# EAGLE design sitrep_display (EAGLE 7.7.0)
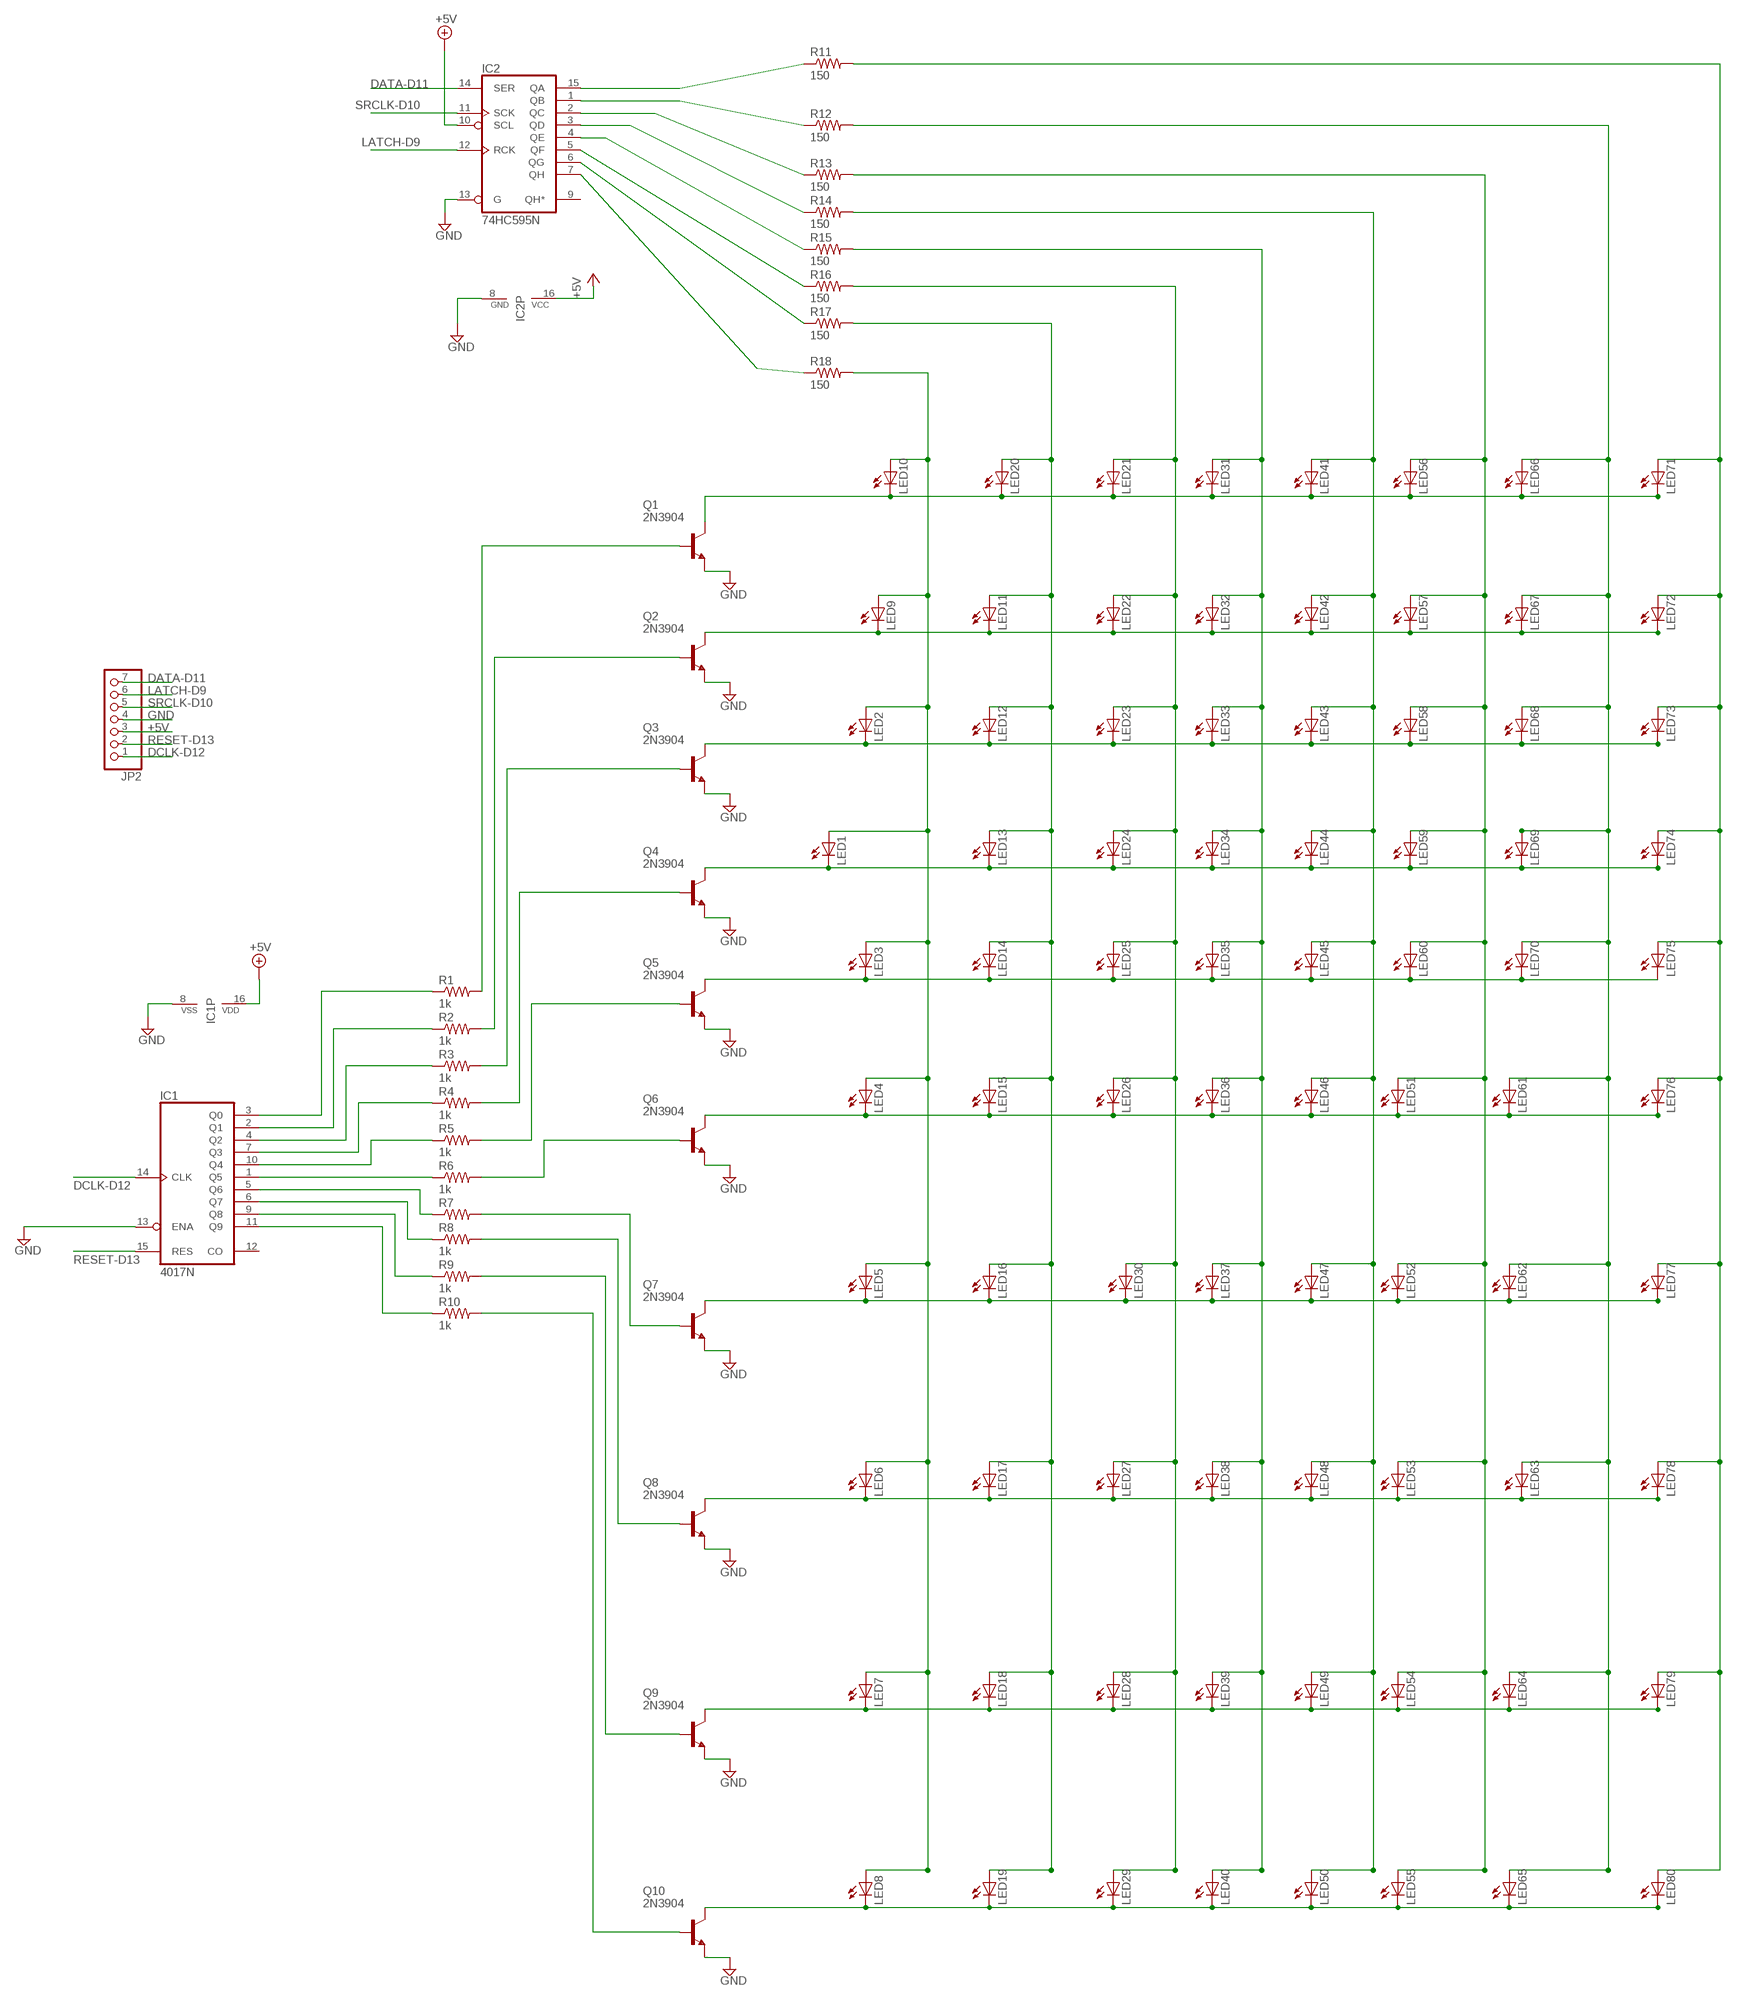
[diagram p0: schematic, sheet 1]

## Parts
IC1  4017N  [DIL16]
IC2  74HC595N  [DIL16]
JP2  PINHD-1X7/90  [1X07/90]
LED1  LED5MM  [LED5MM]
LED2  LED5MM  [LED5MM]
LED3  LED5MM  [LED5MM]
LED4  LED5MM  [LED5MM]
LED5  LED5MM  [LED5MM]
LED6  LED5MM  [LED5MM]
LED7  LED5MM  [LED5MM]
LED8  LED5MM  [LED5MM]
LED9  LED5MM  [LED5MM]
LED10  LED5MM  [LED5MM]
LED11  LED5MM  [LED5MM]
LED12  LED5MM  [LED5MM]
LED13  LED5MM  [LED5MM]
LED14  LED5MM  [LED5MM]
LED15  LED5MM  [LED5MM]
LED16  LED5MM  [LED5MM]
LED17  LED5MM  [LED5MM]
LED18  LED5MM  [LED5MM]
LED19  LED5MM  [LED5MM]
LED20  LED5MM  [LED5MM]
LED21  LED5MM  [LED5MM]
LED22  LED5MM  [LED5MM]
LED23  LED5MM  [LED5MM]
LED24  LED5MM  [LED5MM]
LED25  LED5MM  [LED5MM]
LED26  LED5MM  [LED5MM]
LED27  LED5MM  [LED5MM]
LED28  LED5MM  [LED5MM]
LED29  LED5MM  [LED5MM]
LED30  LED5MM  [LED5MM]
LED31  LED5MM  [LED5MM]
LED32  LED5MM  [LED5MM]
LED33  LED5MM  [LED5MM]
LED34  LED5MM  [LED5MM]
LED35  LED5MM  [LED5MM]
LED36  LED5MM  [LED5MM]
LED37  LED5MM  [LED5MM]
LED38  LED5MM  [LED5MM]
LED39  LED5MM  [LED5MM]
LED40  LED5MM  [LED5MM]
LED41  LED5MM  [LED5MM]
LED42  LED5MM  [LED5MM]
LED43  LED5MM  [LED5MM]
LED44  LED5MM  [LED5MM]
LED45  LED5MM  [LED5MM]
LED46  LED5MM  [LED5MM]
LED47  LED5MM  [LED5MM]
LED48  LED5MM  [LED5MM]
LED49  LED5MM  [LED5MM]
LED50  LED5MM  [LED5MM]
LED51  LED5MM  [LED5MM]
LED52  LED5MM  [LED5MM]
LED53  LED5MM  [LED5MM]
LED54  LED5MM  [LED5MM]
LED55  LED5MM  [LED5MM]
LED56  LED5MM  [LED5MM]
LED57  LED5MM  [LED5MM]
LED58  LED5MM  [LED5MM]
LED59  LED5MM  [LED5MM]
LED60  LED5MM  [LED5MM]
LED61  LED5MM  [LED5MM]
LED62  LED5MM  [LED5MM]
LED63  LED5MM  [LED5MM]
LED64  LED5MM  [LED5MM]
LED65  LED5MM  [LED5MM]
LED66  LED5MM  [LED5MM]
LED67  LED5MM  [LED5MM]
LED68  LED5MM  [LED5MM]
LED69  LED5MM  [LED5MM]
LED70  LED5MM  [LED5MM]
LED71  LED5MM  [LED5MM]
LED72  LED5MM  [LED5MM]
LED73  LED5MM  [LED5MM]
LED74  LED5MM  [LED5MM]
LED75  LED5MM  [LED5MM]
LED76  LED5MM  [LED5MM]
LED77  LED5MM  [LED5MM]
LED78  LED5MM  [LED5MM]
LED79  LED5MM  [LED5MM]
LED80  LED5MM  [LED5MM]
Q1  2N3904  [TO92]
Q2  2N3904  [TO92]
Q3  2N3904  [TO92]
Q4  2N3904  [TO92]
Q5  2N3904  [TO92]
Q6  2N3904  [TO92]
Q7  2N3904  [TO92]
Q8  2N3904  [TO92]
Q9  2N3904  [TO92]
Q10  2N3904  [TO92]
R1  1k  R-US_0204/2V  [0204V]
R2  1k  R-US_0204/2V  [0204V]
R3  1k  R-US_0204/2V  [0204V]
R4  1k  R-US_0204/2V  [0204V]
R5  1k  R-US_0204/2V  [0204V]
R6  1k  R-US_0204/2V  [0204V]
R7  R-US_0204/2V  [0204V]
R8  1k  R-US_0204/2V  [0204V]
R9  1k  R-US_0204/2V  [0204V]
R10  1k  R-US_0204/2V  [0204V]
R11  150  R-US_0207/2V  [0207/2V]
R12  150  R-US_0207/2V  [0207/2V]
R13  150  R-US_0207/2V  [0207/2V]
R14  150  R-US_0207/2V  [0207/2V]
R15  150  R-US_0207/2V  [0207/2V]
R16  150  R-US_0207/2V  [0207/2V]
R17  150  R-US_0207/2V  [0207/2V]
R18  150  R-US_0207/2V  [0207/2V]

## Nets
+5V: IC1.16(VDD) IC2.10(SCL) IC2.16(VCC) JP2.3
DATA-D11: IC2.14(SER) JP2.7
DCLK-D12: IC1.14(CLK) JP2.1
GND: IC1.8(VSS) IC1.13(ENA) IC2.8(GND) IC2.13(G) JP2.4 Q1.3(E) Q2.3(E) Q3.3(E) Q4.3(E) Q5.3(E) Q6.3(E) Q7.3(E) Q8.3(E) Q9.3(E) Q10.3(E)
LATCH-D9: IC2.12(RCK) JP2.6
N$7: IC2.15(QA) R11.1
N$8: IC2.1(QB) R12.1
N$9: IC2.2(QC) R13.1
N$10: IC2.3(QD) R14.1
N$11: IC2.4(QE) R15.1
N$12: IC2.5(QF) R16.1
N$13: IC2.6(QG) R17.1
N$14: IC2.7(QH) R18.1
N$16: LED11.A LED12.A LED13.A LED14.A LED15.A LED16.A LED17.A LED18.A LED19.A LED20.A R17.2
N$17: LED21.A LED22.A LED23.A LED24.A LED25.A LED26.A LED27.A LED28.A LED29.A LED30.A R16.2
N$18: LED31.A LED32.A LED33.A LED34.A LED35.A LED36.A LED37.A LED38.A LED39.A LED40.A R15.2
N$19: LED41.A LED42.A LED43.A LED44.A LED45.A LED46.A LED47.A LED48.A LED49.A LED50.A R14.2
N$20: LED51.A LED52.A LED53.A LED54.A LED55.A LED56.A LED57.A LED58.A LED59.A LED60.A R13.2
N$21: LED61.A LED62.A LED63.A LED64.A LED65.A LED66.A LED67.A LED68.A LED69.A LED70.A R12.2
N$22: LED71.A LED72.A LED73.A LED74.A LED75.A LED76.A LED77.A LED78.A LED79.A LED80.A R11.2
N$24: LED1.A LED2.A LED3.A LED4.A LED5.A LED6.A LED7.A LED8.A LED9.A LED10.A R18.2
N$30: LED10.K(C) LED20.K(C) LED21.K(C) LED31.K(C) LED41.K(C) LED56.K(C) LED66.K(C) LED71.K(C) Q1.1(C)
N$31: LED9.K(C) LED11.K(C) LED22.K(C) LED32.K(C) LED42.K(C) LED57.K(C) LED67.K(C) LED72.K(C) Q2.1(C)
N$32: LED3.K(C) LED14.K(C) LED25.K(C) LED35.K(C) LED45.K(C) LED60.K(C) LED70.K(C) LED75.K(C) Q5.1(C)
N$33: LED1.K(C) LED13.K(C) LED24.K(C) LED34.K(C) LED44.K(C) LED59.K(C) LED69.K(C) LED74.K(C) Q4.1(C)
N$35: LED4.K(C) LED15.K(C) LED26.K(C) LED36.K(C) LED46.K(C) LED51.K(C) LED61.K(C) LED76.K(C) Q6.1(C)
N$37: LED5.K(C) LED16.K(C) LED30.K(C) LED37.K(C) LED47.K(C) LED52.K(C) LED62.K(C) LED77.K(C) Q7.1(C)
N$38: LED6.K(C) LED17.K(C) LED27.K(C) LED38.K(C) LED48.K(C) LED53.K(C) LED63.K(C) LED78.K(C) Q8.1(C)
N$39: LED2.K(C) LED12.K(C) LED23.K(C) LED33.K(C) LED43.K(C) LED58.K(C) LED68.K(C) LED73.K(C) Q3.1(C)
N$48: LED7.K(C) LED18.K(C) LED28.K(C) LED39.K(C) LED49.K(C) LED54.K(C) LED64.K(C) LED79.K(C) Q9.1(C)
N$57: LED8.K(C) LED19.K(C) LED29.K(C) LED40.K(C) LED50.K(C) LED55.K(C) LED65.K(C) LED80.K(C) Q10.1(C)
N$58: Q1.2(B) R1.2
N$59: Q2.2(B) R2.2
N$60: Q3.2(B) R3.2
N$61: Q4.2(B) R4.2
N$62: Q5.2(B) R5.2
N$63: Q6.2(B) R6.2
N$64: Q7.2(B) R7.2
N$65: Q8.2(B) R8.2
N$66: Q9.2(B) R9.2
N$67: Q10.2(B) R10.2
N$68: IC1.3(Q0) R1.1
N$69: IC1.2(Q1) R2.1
N$70: IC1.4(Q2) R3.1
N$71: IC1.7(Q3) R4.1
N$72: IC1.10(Q4) R5.1
N$73: IC1.1(Q5) R6.1
N$74: IC1.5(Q6) R7.1
N$75: IC1.6(Q7) R8.1
N$76: IC1.9(Q8) R9.1
N$77: IC1.11(Q9) R10.1
RESET-D13: IC1.15(RES) JP2.2
SRCLK-D10: IC2.11(SCK) JP2.5
Unconnected: IC1.12(CO) IC2.9(QH*)

## Library data of the parts
IC1 = 40xx:4017: COUNTER/DIVIDER
IC2 = 74xx-eu:74*595: 8-bit SHIFT REGISTER, output latch
JP2 = pinhead:PINHD-1X7: PIN HEADER
LED1-LED80 = adafruit:LED: LED OSRAM: - CHIPLED LG R971, LG N971, LY N971, LG Q971, LY Q971, LO R971, LY R971 LH N974, LH R974 LS Q976, LO Q976, LY Q976 LO Q996 - Hyper CHIPLED LW Q18S LB Q993, LB Q99A, LB R99A - SideLED LS A670, LO A670, LY A670, LG A670, LP A670 LB A673, LV A673, LT A673, LW A673 LH A674 LY A675 LS A676, LA A676, LO A676, LY A676, LW A676 LS A679, LY A679, LG A679 - Hyper Micro SIDELED® LS Y876, LA Y876, LO Y876, LY Y876 LT Y87S - SmartLED LW L88C, LW L88S LB L89C, LB L89S, LG L890 LS L89K, LO L89K, LY L89K LS L896, LA L896, LO L896, LY L896 - TOPLED LS T670, LO T670, LY T670, LG T670, LP T670 LSG T670, LSP T670, LSY T670, LOP T670, LYG T670 LG T671, LOG T671, LSG T671 LB T673, LV T673, LT T673, LW T673 LH T674 LS T676, LA T676, LO T676, LY T676, LB T676, LH T676, LSB T676, LW T676 LB T67C, LV T67C, LT T67C, LS T67K, LO T67K, LY T67K, LW E67C LS E67B, LA E67B, LO E67B, LY E67B, LB E67C, LV E67C, LT E67C LW T67C LS T679, LY T679, LG T679 LS T770, LO T770, LY T770, LG T770, LP T770 LB T773, LV T773, LT T773, LW T773 LH T774 LS E675, LA E675, LY E675, LS T675 LS T776, LA T776, LO T776, LY T776, LB T776 LHGB T686 LT T68C, LB T68C - Hyper Mini TOPLED® LB M676 - Mini TOPLED Santana® LG M470 LS M47K, LO M47K, LY M47K Source: http://www.osram.convergy.de/
Q1-Q10 = transistor-npn:2N3904: NPN Transistor
R1-R10 = resistor:R-US_: RESISTOR, American symbol
R11-R18 = adafruit:R-US_: RESISTOR, American symbol

## Net classes
0 default: width 0.305 mm, drill 0.508 mm, clearance 0.254 mm

## Board
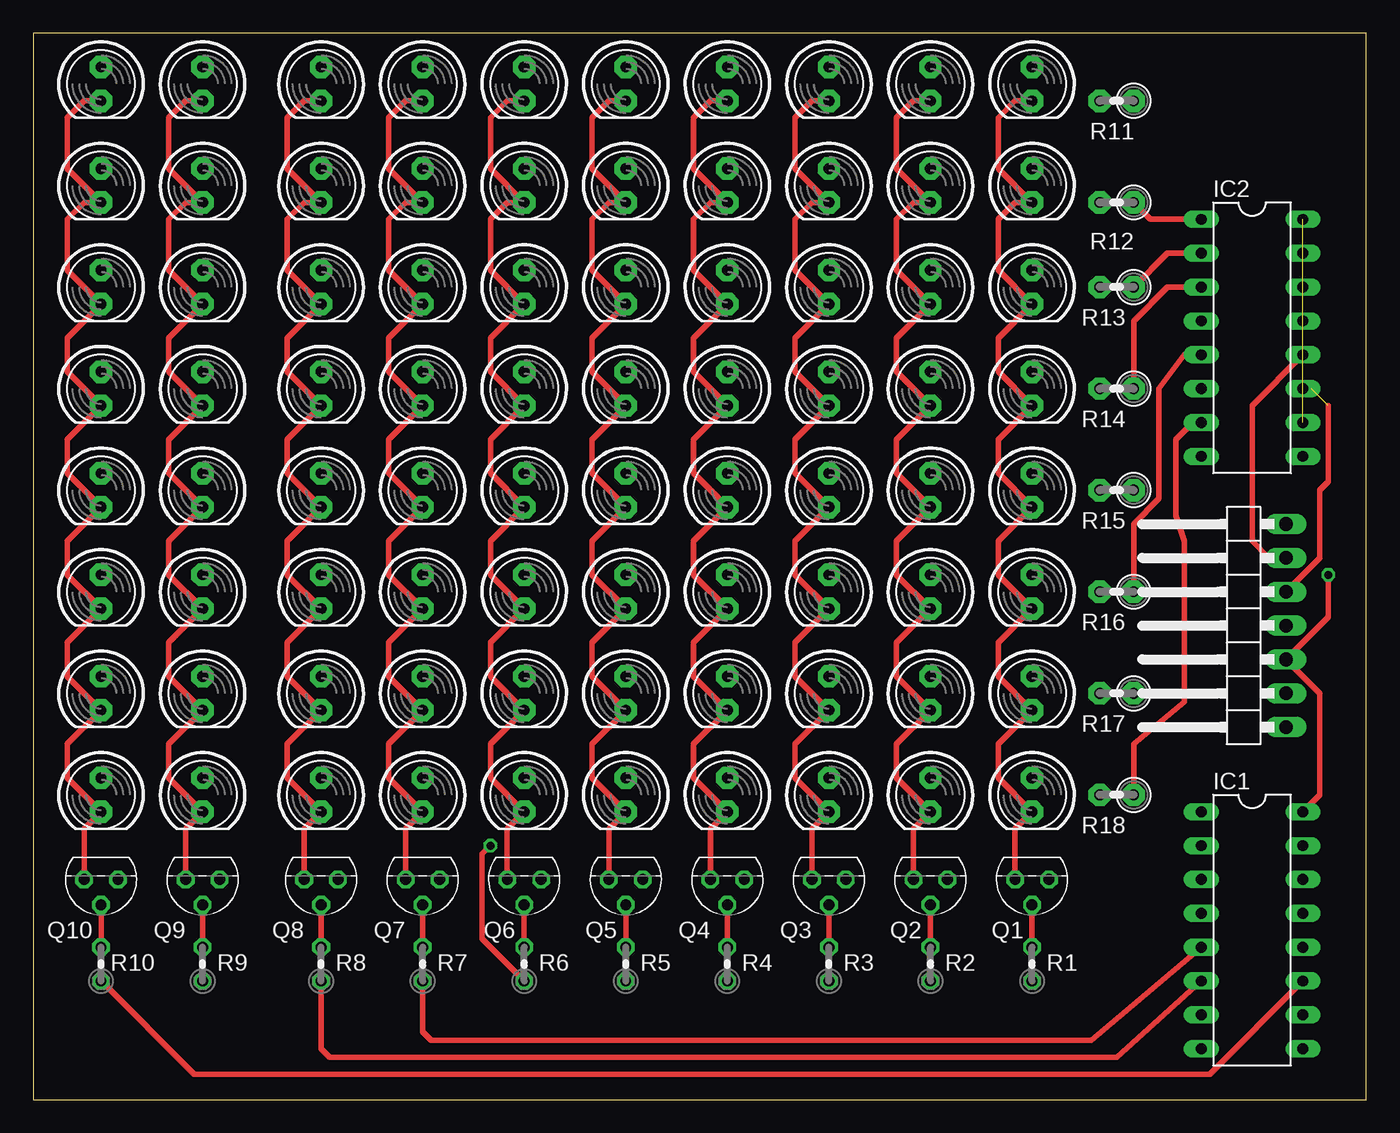
[diagram p1: board, top side]
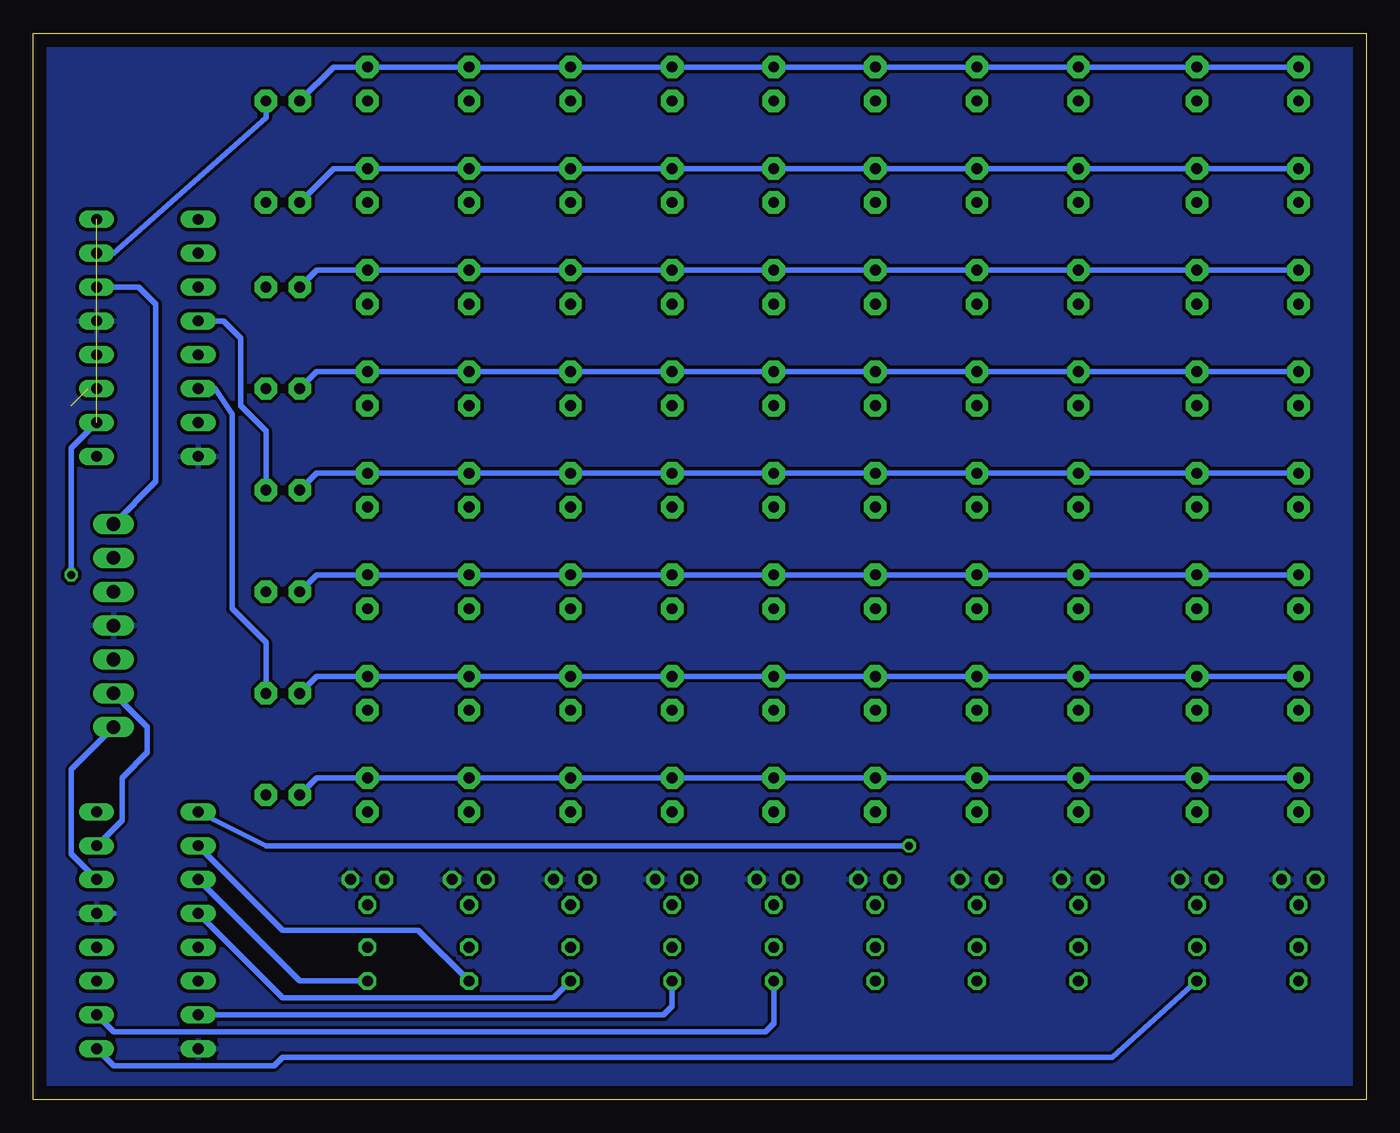
[diagram p2: board, bottom side, seen from below]

Size 100 x 80 mm. Coordinates in mm from the lower left corner, seen from the top.
Outline: 0,0 100,0 100,80 0,80 0,0
Copper layers (1*16): Top 0.035mm / dielectric 1.5mm / Bottom 0.035mm
Design rules "default *": minimum track width 10mil, minimum drill 20mil, track to track 8mil, track to pad 8mil, pad to pad 8mil, via to via 8mil, smd to smd 8mil, copper to edge 40mil, drill to drill 8mil, minimum pad ring 10mil, minimum via ring 8mil, stop-mask expansion 4mil, vias tented up to drill 0mil, thermal gap 10mil

### Footprints (pad centres in the part's own frame; a part is rotated, then mirrored left to right if it is on the bottom)
DIL16 = drill 0.813 long: 1 -8.89,-3.81; 2 -6.35,-3.81; 3 -3.81,-3.81; 4 -1.27,-3.81; 5 1.27,-3.81; 6 3.81,-3.81; 7 6.35,-3.81; 8 8.89,-3.81; 9 8.89,3.81; 10 6.35,3.81; 11 3.81,3.81; 12 1.27,3.81; 13 -1.27,3.81; 14 -3.81,3.81; 15 -6.35,3.81; 16 -8.89,3.81
1X07/90 = drill 1.016 long: 1 -7.62,-3.81; 2 -5.08,-3.81; 3 -2.54,-3.81; 4 0,-3.81; 5 2.54,-3.81; 6 5.08,-3.81; 7 7.62,-3.81
LED5MM = drill 0.813 pad 1.676 octagon: A -1.27,0; K 1.27,0
TO92 = drill 0.813 octagon: 1 1.27,0; 2 0,1.905; 3 -1.27,0
0204V = drill 0.813 octagon: 1 -1.27,0; 2 1.27,0
0207/2V = drill 0.813 pad 1.676 octagon: 1 -1.27,0; 2 1.27,0

### Placement (x,y rotation side)
IC1  91.44,12.7 270 top
IC2  91.44,57.15 270 top
JP2  90.17,35.56 90 top
LED1  52.07,22.86 270 top
LED2  59.69,22.86 270 top
LED3  44.45,22.86 270 top
LED4  36.83,22.86 270 top
LED5  29.21,22.86 270 top
LED6  21.59,22.86 270 top
LED7  12.7,22.86 270 top
LED8  5.08,22.86 270 top
LED9  67.31,22.86 270 top
LED10  74.93,22.86 270 top
LED11  67.31,30.48 270 top
LED12  59.69,30.48 270 top
LED13  52.07,30.48 270 top
LED14  44.45,30.48 270 top
LED15  36.83,30.48 270 top
LED16  29.21,30.48 270 top
LED17  21.59,30.48 270 top
LED18  12.7,30.48 270 top
LED19  5.08,30.48 270 top
LED20  74.93,30.48 270 top
LED21  74.93,38.1 270 top
LED22  67.31,38.1 270 top
LED23  59.69,38.1 270 top
LED24  52.07,38.1 270 top
LED25  44.45,38.1 270 top
LED26  36.83,38.1 270 top
LED27  21.59,38.1 270 top
LED28  12.7,38.1 270 top
LED29  5.08,38.1 270 top
LED30  29.21,38.1 270 top
LED31  74.93,45.72 270 top
LED32  67.31,45.72 270 top
LED33  59.69,45.72 270 top
LED34  52.07,45.72 270 top
LED35  44.45,45.72 270 top
LED36  36.83,45.72 270 top
LED37  29.21,45.72 270 top
LED38  21.59,45.72 270 top
LED39  12.7,45.72 270 top
LED40  5.08,45.72 270 top
LED41  74.93,53.34 270 top
LED42  67.31,53.34 270 top
LED43  59.69,53.34 270 top
LED44  52.07,53.34 270 top
LED45  44.45,53.34 270 top
LED46  36.83,53.34 270 top
LED47  29.21,53.34 270 top
LED48  21.59,53.34 270 top
LED49  12.7,53.34 270 top
LED50  5.08,53.34 270 top
LED51  36.83,60.96 270 top
LED52  29.21,60.96 270 top
LED53  21.59,60.96 270 top
LED54  12.7,60.96 270 top
LED55  5.08,60.96 270 top
LED56  74.93,60.96 270 top
LED57  67.31,60.96 270 top
LED58  59.69,60.96 270 top
LED59  52.07,60.96 270 top
LED60  44.45,60.96 270 top
LED61  36.83,68.58 270 top
LED62  29.21,68.58 270 top
LED63  21.59,68.58 270 top
LED64  12.7,68.58 270 top
LED65  5.08,68.58 270 top
LED66  74.93,68.58 270 top
LED67  67.31,68.58 270 top
LED68  59.69,68.58 270 top
LED69  52.07,68.58 270 top
LED70  44.45,68.58 270 top
LED71  74.93,76.2 270 top
LED72  67.31,76.2 270 top
LED73  59.69,76.2 270 top
LED74  52.07,76.2 270 top
LED75  44.45,76.2 270 top
LED76  36.83,76.2 270 top
LED77  29.21,76.2 270 top
LED78  21.59,76.2 270 top
LED79  12.7,76.2 270 top
LED80  5.08,76.2 270 top
Q1  74.93,16.51 180 top
Q2  67.31,16.51 180 top
Q3  59.69,16.51 180 top
Q4  52.07,16.51 180 top
Q5  44.45,16.51 180 top
Q6  36.83,16.51 180 top
Q7  29.21,16.51 180 top
Q8  21.59,16.51 180 top
Q9  12.7,16.51 180 top
Q10  5.08,16.51 180 top
R1  74.93,10.16 90 top
R2  67.31,10.16 90 top
R3  59.69,10.16 90 top
R4  52.07,10.16 90 top
R5  44.45,10.16 90 top
R6  36.83,10.16 90 top
R7  29.21,10.16 90 top
R8  21.59,10.16 90 top
R9  12.7,10.16 90 top
R10  5.08,10.16 90 top
R11  81.28,74.93 180 top
R12  81.28,67.31 180 top
R13  81.28,60.96 180 top
R14  81.28,53.34 180 top
R15  81.28,45.72 180 top
R16  81.28,38.1 180 top
R17  81.28,30.48 180 top
R18  81.28,22.86 180 top

### Tracks (layer width: path | path; a pad name or v marks a point on that pad's centre or on a via)
+5V  (via drill 0.6)  (1 unrouted)
  Top 0.406: v97.16,39.37 97.16,36.2 JP2.3 96.52,30.48 96.52,22.86 IC1.16
  Bottom 0.406: v97.16,39.37 97.16,48.9 IC2.10
DATA-D11
  Bottom 0.406: IC2.14 92.08,60.96 90.81,59.69 90.81,46.35 JP2.7
DCLK-D12
  Bottom 0.406: JP2.1 97.16,24.77 97.16,18.41 IC1.14
GND
  Bottom 0.406: 95.89,13.97 IC1.13 93.98,13.97
  pour Bottom: 0,80.01 100.33,80.01 100.33,0 0,0
LATCH-D9
  Top 0.406: JP2.6 92.71,40.64 91.44,41.91 91.44,52.07 IC2.12
N$7
  Bottom 0.406: R11.1 82.55,73.66 93.98,63.5 IC2.15
N$8
  Top 0.406: IC2.1 83.82,66.04 R12.1
N$9
  Top 0.406: IC2.2 85.09,63.5 R13.1
N$10
  Top 0.406: IC2.3 85.09,60.96 82.55,58.42 R14.1
N$11
  Bottom 0.406: IC2.4 85.72,58.42 84.45,57.15 84.45,52.07 82.55,50.16 R15.1
N$12
  Top 0.406: R16.1 82.55,43.18 84.45,45.09 84.45,53.34 86.36,55.88 IC2.5
N$13
  Bottom 0.406: IC2.6 86.36,53.34 85.09,51.44 85.09,36.83 82.55,34.29 R17.1
N$14
  Top 0.406: IC2.7 87,50.8 85.72,49.53 85.72,43.81 86.36,41.91 86.36,29.84 82.55,26.67 R18.1
N$16
  Bottom 0.406: LED19.A LED18.A LED17.A LED16.A LED15.A LED14.A LED13.A LED12.A LED11.A LED20.A 78.74,31.75 R17.2
N$17
  Bottom 0.406: LED29.A LED28.A LED27.A LED30.A LED26.A LED25.A LED24.A LED23.A LED22.A LED21.A 78.74,39.37 R16.2
N$18
  Bottom 0.406: LED40.A LED39.A LED38.A LED37.A LED36.A LED35.A LED34.A LED33.A LED32.A LED31.A 78.74,46.99 R15.2
N$19
  Bottom 0.406: LED50.A LED49.A LED48.A LED47.A LED46.A LED45.A LED44.A LED43.A LED42.A LED41.A 78.74,54.61 R14.2
N$20
  Bottom 0.406: LED55.A LED54.A LED53.A LED52.A LED51.A LED60.A LED59.A LED58.A LED57.A LED56.A 78.74,62.23 R13.2
N$21
  Bottom 0.406: R12.2 77.47,69.85 LED66.A LED67.A LED68.A LED69.A LED70.A LED61.A LED62.A LED63.A LED64.A LED65.A
N$22
  Bottom 0.406: R11.2 77.47,77.47 LED71.A LED72.A LED73.A LED74.A LED75.A LED76.A LED77.A LED78.A LED79.A LED80.A
N$24
  Bottom 0.406: LED8.A LED7.A LED6.A LED5.A LED4.A LED3.A LED1.A LED2.A LED9.A LED10.A 78.74,24.13 R18.2
N$30
  Top 0.406: Q1.1 73.66,20.32 LED10.K 72.39,24.13 72.39,26.67 LED20.K 72.39,31.75 72.39,34.29 LED21.K 72.39,39.37 72.39,41.91 LED31.K 72.39,46.99 72.39,49.53 LED41.K 72.39,54.61 72.39,57.15 LED56.K 72.39,62.23 72.39,66.04 73.66,67.31 LED66.K 72.39,69.85 72.39,73.66 73.66,74.93 LED71.K
N$31
  Top 0.406: Q2.1 66.04,20.32 LED9.K 64.77,24.13 64.77,26.67 LED11.K 64.77,31.75 64.77,34.29 LED22.K 64.77,39.37 64.77,41.91 LED32.K 64.77,46.99 64.77,49.53 LED42.K 64.77,54.61 64.77,57.15 LED57.K 64.77,62.23 64.77,66.04 66.04,67.31 LED67.K 64.77,69.85 64.77,73.66 66.04,74.93 LED72.K
N$32
  Top 0.406: Q5.1 43.18,20.32 LED3.K 41.91,24.13 41.91,26.67 LED14.K 41.91,31.75 41.91,34.29 LED25.K 41.91,39.37 41.91,41.91 LED35.K 41.91,46.99 41.91,49.53 LED45.K 41.91,54.61 41.91,57.15 LED60.K 41.91,62.23 41.91,66.04 43.18,67.31 LED70.K 41.91,69.85 41.91,73.66 43.18,74.93 LED75.K
N$33
  Top 0.406: Q4.1 50.8,20.32 LED1.K 49.53,24.13 49.53,26.67 LED13.K 49.53,31.75 49.53,34.29 LED24.K 49.53,39.37 49.53,41.91 LED34.K 49.53,46.99 49.53,49.53 LED44.K 49.53,54.61 49.53,57.15 LED59.K 49.53,62.23 49.53,66.04 50.8,67.31 LED69.K 49.53,69.85 49.53,73.66 50.8,74.93 LED74.K
N$35
  Top 0.406: Q6.1 35.56,20.32 LED4.K 34.29,24.13 34.29,26.67 LED15.K 34.29,31.75 34.29,34.29 LED26.K 34.29,39.37 34.29,41.91 LED36.K 34.29,46.99 34.29,49.53 LED46.K 34.29,54.61 34.29,57.15 LED51.K 34.29,62.23 34.29,66.04 35.56,67.31 LED61.K 34.29,69.85 34.29,73.66 35.56,74.93 LED76.K
N$37
  Top 0.406: Q7.1 27.94,20.32 LED5.K 26.67,24.13 26.67,26.67 LED16.K 26.67,31.75 26.67,34.29 LED30.K 26.67,39.37 26.67,41.91 LED37.K 26.67,46.99 26.67,49.53 LED47.K 26.67,54.61 26.67,57.15 LED52.K 26.67,62.23 26.67,66.04 27.94,67.31 LED62.K 26.67,69.85 26.67,73.66 27.94,74.93 LED77.K
N$38
  Top 0.406: Q8.1 20.32,20.32 LED6.K 19.05,24.13 19.05,26.67 LED17.K 19.05,31.75 19.05,34.29 LED27.K 19.05,39.37 19.05,41.91 LED38.K 19.05,46.99 19.05,49.53 LED48.K 19.05,54.61 19.05,57.15 LED53.K 19.05,62.23 19.05,66.04 20.32,67.31 LED63.K 19.05,69.85 19.05,73.66 20.32,74.93 LED78.K
N$39
  Top 0.406: Q3.1 58.42,20.32 LED2.K 57.15,24.13 57.15,26.67 LED12.K 57.15,31.75 57.15,34.29 LED23.K 57.15,39.37 57.15,41.91 LED33.K 57.15,46.99 57.15,49.53 LED43.K 57.15,54.61 57.15,57.15 LED58.K 57.15,62.23 57.15,66.04 58.42,67.31 LED68.K 57.15,69.85 57.15,73.66 58.42,74.93 LED73.K
N$48
  Top 0.406: Q9.1 11.43,20.32 LED7.K 10.16,24.13 10.16,26.67 LED18.K 10.16,31.75 10.16,34.29 LED28.K 10.16,39.37 10.16,41.91 LED39.K 10.16,46.99 10.16,49.53 LED49.K 10.16,54.61 10.16,57.15 LED54.K 10.16,62.23 10.16,66.04 11.43,67.31 LED64.K 10.16,69.85 10.16,73.66 11.43,74.93 LED79.K
N$57
  Top 0.406: Q10.1 3.81,20.32 LED8.K 2.54,24.13 2.54,26.67 LED19.K 2.54,31.75 2.54,34.29 LED29.K 2.54,39.37 2.54,41.91 LED40.K 2.54,46.99 2.54,49.53 LED50.K 2.54,54.61 2.54,57.15 LED55.K 2.54,62.23 2.54,66.04 3.81,67.31 LED65.K 2.54,69.85 2.54,73.66 3.81,74.93 LED80.K
N$58
  Top 0.406: Q1.2 R1.2
N$59
  Top 0.406: Q2.2 R2.2
N$60
  Top 0.406: Q3.2 R3.2
N$61
  Top 0.406: Q4.2 R4.2
N$62
  Top 0.406: Q5.2 R5.2
N$63
  Top 0.406: Q6.2 R6.2
N$64
  Top 0.406: Q7.2 R7.2
N$65
  Top 0.406: Q8.2 R8.2
N$66
  Top 0.406: Q9.2 R9.2
N$67
  Top 0.406: Q10.2 R10.2
N$68
  Bottom 0.406: R1.1 80.01,8.89 IC1.3
N$69
  Bottom 0.406: IC1.2 81.28,12.7 71.12,12.7 R2.1
N$70
  Bottom 0.406: IC1.4 81.28,7.62 60.96,7.62 R3.1
N$71
  Bottom 0.406: IC1.7 52.7,6.35 52.07,6.99 R4.1
N$72
  Bottom 0.406: IC1.10 93.98,5.08 45.09,5.08 44.45,5.71 R5.1
N$73  (via drill 0.6)
  Top 0.406: v34.29,19.05 33.66,18.41 33.66,12.06 R6.1
  Bottom 0.406: IC1.1 82.55,19.05 v34.29,19.05
N$74
  Top 0.406: IC1.5 79.38,4.45 29.84,4.45 29.21,5.08 R7.1
N$75
  Top 0.406: R8.1 21.59,3.81 22.23,3.17 81.28,3.17 IC1.6
N$76
  Bottom 0.406: IC1.9 93.98,2.54 81.92,2.54 81.28,3.17 19.05,3.17 R9.1
N$77
  Top 0.406: R10.1 12.06,1.91 88.27,1.91 IC1.11
RESET-D13
  Bottom 0.406: JP2.2 91.44,27.94 91.44,26.04 93.34,24.13 93.34,20.95 IC1.15
SRCLK-D10  (1 unrouted)
  Top 0.406: IC2.11 95.89,53.34 | 97.16,52.07 97.16,46.35 96.52,45.72 96.52,40.64 JP2.5